# Altium project ZigBug.PrjPcb
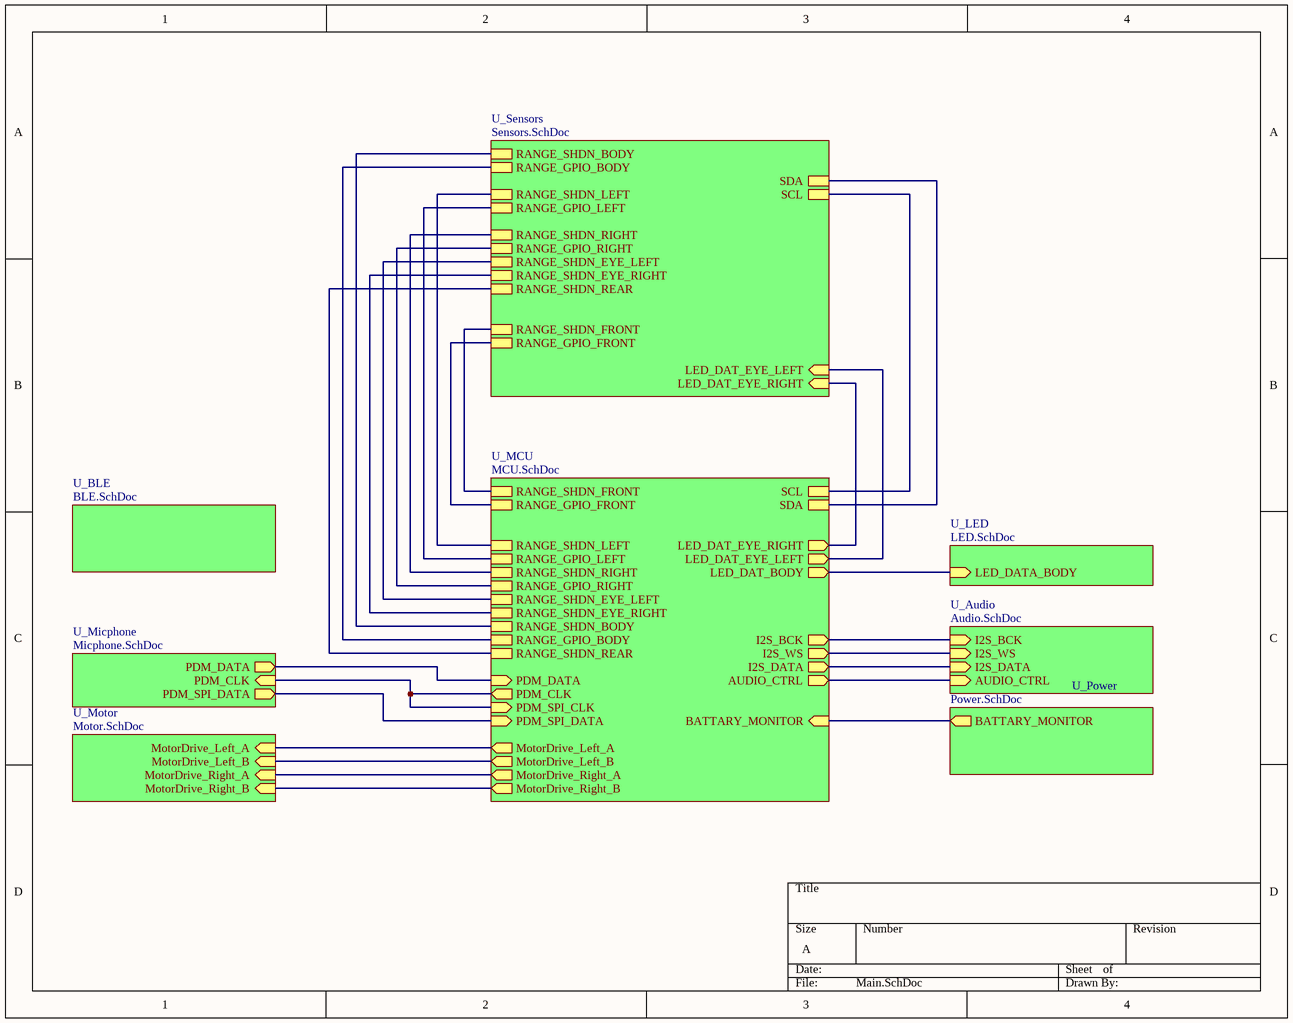
[diagram p0: Main.SchDoc]
9 sheets, 89 parts. Net scope: hierarchical (ports join the sheet entries above them; power ports are global).
Board file: ZigBug.PcbDoc
Sheets:
  Main.SchDoc
    U_Audio = Audio.SchDoc
    U_LED = LED.SchDoc
    U_MCU = MCU.SchDoc
    U_Micphone = Micphone.SchDoc
    U_Motor = Motor.SchDoc
    U_Power = Power.SchDoc
    U_Sensors = Sensors.SchDoc
    U_BLE = BLE.SchDoc

## Sheet Main.SchDoc
size A

### Sub-sheets
U_Audio = Audio.SchDoc: I2S_BCK (in), I2S_WS (in), I2S_DATA (in), AUDIO_CTRL (in)
U_BLE = BLE.SchDoc: no entries
U_LED = LED.SchDoc: LED_DATA_BODY (in)
U_MCU = MCU.SchDoc: RANGE_SHDN_FRONT, RANGE_GPIO_FRONT, SDA, SCL, LED_DAT_BODY (out), LED_DAT_EYE_RIGHT (out), LED_DAT_EYE_LEFT (out), RANGE_SHDN_LEFT, RANGE_GPIO_LEFT, RANGE_SHDN_RIGHT, RANGE_GPIO_RIGHT, RANGE_SHDN_EYE_LEFT, RANGE_SHDN_EYE_RIGHT, RANGE_SHDN_BODY, RANGE_GPIO_BODY, RANGE_SHDN_REAR, PDM_DATA (in), PDM_CLK (out), PDM_SPI_DATA (in), MotorDrive_Left_A (out), MotorDrive_Left_B (out), MotorDrive_Right_A (out), MotorDrive_Right_B (out), BATTARY_MONITOR (in), I2S_BCK (out), I2S_WS (out), I2S_DATA (out), PDM_SPI_CLK (in), AUDIO_CTRL (out)
U_Micphone = Micphone.SchDoc: PDM_DATA (out), PDM_CLK (in), PDM_SPI_DATA (out)
U_Motor = Motor.SchDoc: MotorDrive_Left_A (in), MotorDrive_Left_B (in), MotorDrive_Right_A (in), MotorDrive_Right_B (in)
U_Power = Power.SchDoc: BATTARY_MONITOR (out)
U_Sensors = Sensors.SchDoc: RANGE_SHDN_BODY, RANGE_GPIO_BODY, SDA, SCL, RANGE_SHDN_LEFT, RANGE_GPIO_LEFT, RANGE_SHDN_RIGHT, RANGE_GPIO_RIGHT, RANGE_SHDN_EYE_LEFT, RANGE_SHDN_EYE_RIGHT, RANGE_SHDN_REAR, RANGE_SHDN_FRONT, RANGE_GPIO_FRONT, LED_DAT_EYE_RIGHT (in), LED_DAT_EYE_LEFT (in)

### Nets
GPIO_OUT: sheet U_MCU/RANGE_GPIO_BODY, sheet U_Sensors/RANGE_GPIO_BODY
I2S_BCK: sheet U_Audio/I2S_BCK, sheet U_MCU/I2S_BCK
I2S_DATA: sheet U_Audio/I2S_DATA, sheet U_MCU/I2S_DATA
I2S_WS: sheet U_Audio/I2S_WS, sheet U_MCU/I2S_WS
LED_DATA: sheet U_LED/LED_DATA_BODY, sheet U_MCU/LED_DAT_BODY
SCL: sheet U_MCU/SCL, sheet U_Sensors/SCL
SDA: sheet U_MCU/SDA, sheet U_Sensors/SDA
SHDN: sheet U_MCU/RANGE_SHDN_BODY, sheet U_Sensors/RANGE_SHDN_BODY
NetC22_1: sheet U_MCU/BATTARY_MONITOR, sheet U_Power/BATTARY_MONITOR
NetP1_1: sheet U_MCU/RANGE_SHDN_LEFT, sheet U_Sensors/RANGE_SHDN_LEFT
NetP1_2: sheet U_MCU/RANGE_SHDN_FRONT, sheet U_Sensors/RANGE_SHDN_FRONT
NetP1_3: sheet U_MCU/RANGE_GPIO_LEFT, sheet U_Sensors/RANGE_GPIO_LEFT
NetP1_4: sheet U_MCU/RANGE_GPIO_FRONT, sheet U_Sensors/RANGE_GPIO_FRONT
NetP1_5: sheet U_MCU/RANGE_SHDN_RIGHT, sheet U_Sensors/RANGE_SHDN_RIGHT
NetP1_7: sheet U_MCU/RANGE_GPIO_RIGHT, sheet U_Sensors/RANGE_GPIO_RIGHT
NetP1_9: sheet U_MCU/RANGE_SHDN_EYE_LEFT, sheet U_Sensors/RANGE_SHDN_EYE_LEFT
NetP1_11: sheet U_MCU/RANGE_SHDN_EYE_RIGHT, sheet U_Sensors/RANGE_SHDN_EYE_RIGHT
NetP1_12: sheet U_MCU/MotorDrive_Right_B, sheet U_Motor/MotorDrive_Right_B
NetP1_13: sheet U_MCU/MotorDrive_Left_A, sheet U_Motor/MotorDrive_Left_A
NetP1_14: sheet U_MCU/PDM_CLK, sheet U_MCU/PDM_SPI_CLK, sheet U_Micphone/PDM_CLK
NetP1_15: sheet U_MCU/MotorDrive_Left_B, sheet U_Motor/MotorDrive_Left_B
NetP1_16: sheet U_MCU/PDM_SPI_DATA, sheet U_Micphone/PDM_SPI_DATA
NetP1_17: sheet U_MCU/MotorDrive_Right_A, sheet U_Motor/MotorDrive_Right_A
NetP2_6: sheet U_MCU/LED_DAT_EYE_RIGHT, sheet U_Sensors/LED_DAT_EYE_RIGHT
NetP2_7: sheet U_MCU/LED_DAT_EYE_LEFT, sheet U_Sensors/LED_DAT_EYE_LEFT
NetP2_9: sheet U_MCU/RANGE_SHDN_REAR, sheet U_Sensors/RANGE_SHDN_REAR
NetP2_11: sheet U_MCU/PDM_DATA, sheet U_Micphone/PDM_DATA
NetP2_18: sheet U_Audio/AUDIO_CTRL, sheet U_MCU/AUDIO_CTRL

## Sheet Audio.SchDoc
size A
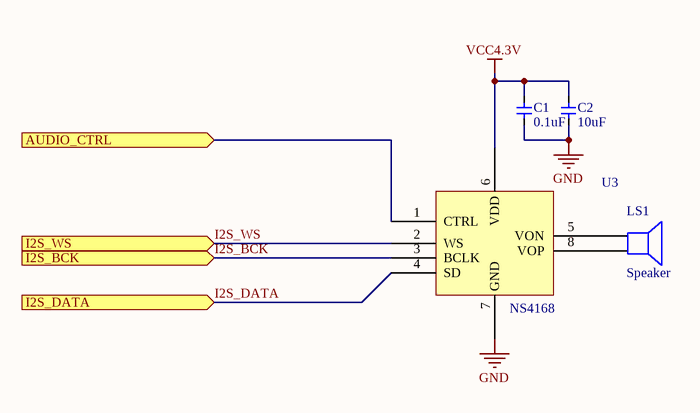
[diagram p1: Audio.SchDoc]

### Parts
C1  value 0.1uF  [CAP_0603]  (hidden comment: Cap_0603)
C2  value 10uF  [CAP_0603]  (hidden comment: Cap_0603)
LS1  Speaker  [PIN2]
U3  NS4168  [SOP_E150_8]

### Ports
AUDIO_CTRL (in), I2S_BCK (in), I2S_DATA (in), I2S_WS (in)

### Nets
GND: C1.1 C2.1 U3.7(GND)
VCC4.3V: C1.2 C2.2 U3.6(VDD)
I2S_BCK: U3.3(BCLK) ; port I2S_BCK
I2S_DATA: U3.4(SD) ; port I2S_DATA
I2S_WS: U3.2(WS) ; port I2S_WS
NetLS1_1: LS1.1 U3.5(VON)
NetLS1_2: LS1.2 U3.8(VOP)
NetP2_18: U3.1(CTRL) ; port AUDIO_CTRL

### Library data of the parts
C1 C2 = Cap_0603: Capacitor
LS1 = Speaker: Loudspeaker; Published: 24-Mar-1999; LatestRevisionDate: 17-Jul-2002; LatestRevisionNote: Re-released for DXP Platform.; PackageReference: PIN2; Publisher: Altium Limited
U3 = NS4168: D Class Audio Amp with I2S input

## Sheet LED.SchDoc
size A
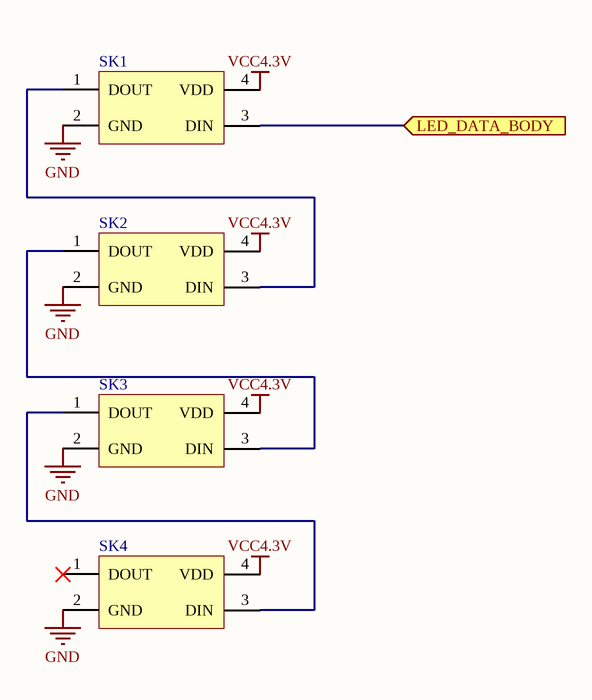
[diagram p2: LED.SchDoc]

### Parts
SK1  LED_3535_SK6812  [LED_3535_4P]  (value not drawn)
SK2  LED_3535_SK6812  [LED_3535_4P]  (value not drawn)
SK3  LED_3535_SK6812  [LED_3535_4P]  (value not drawn)
SK4  LED_3535_SK6812  [LED_3535_4P]  (value not drawn)

### Ports
LED_DATA_BODY (in)

### Nets
GND: SK1.2(GND) SK2.2(GND) SK3.2(GND) SK4.2(GND)
VCC4.3V: SK1.4(VDD) SK2.4(VDD) SK3.4(VDD) SK4.4(VDD)
LED_DATA: SK1.3(DIN) ; port LED_DATA_BODY
NetSK1_1: SK1.1(DOUT) SK2.3(DIN)
NetSK2_1: SK2.1(DOUT) SK3.3(DIN)
NetSK3_1: SK3.1(DOUT) SK4.3(DIN)

Not connected (* = marked no-connect by the designer): SK4 1(DOUT)*

### Library data of the parts
SK1-SK4 = LED_3535_SK6812: LED

## Sheet MCU.SchDoc
size A
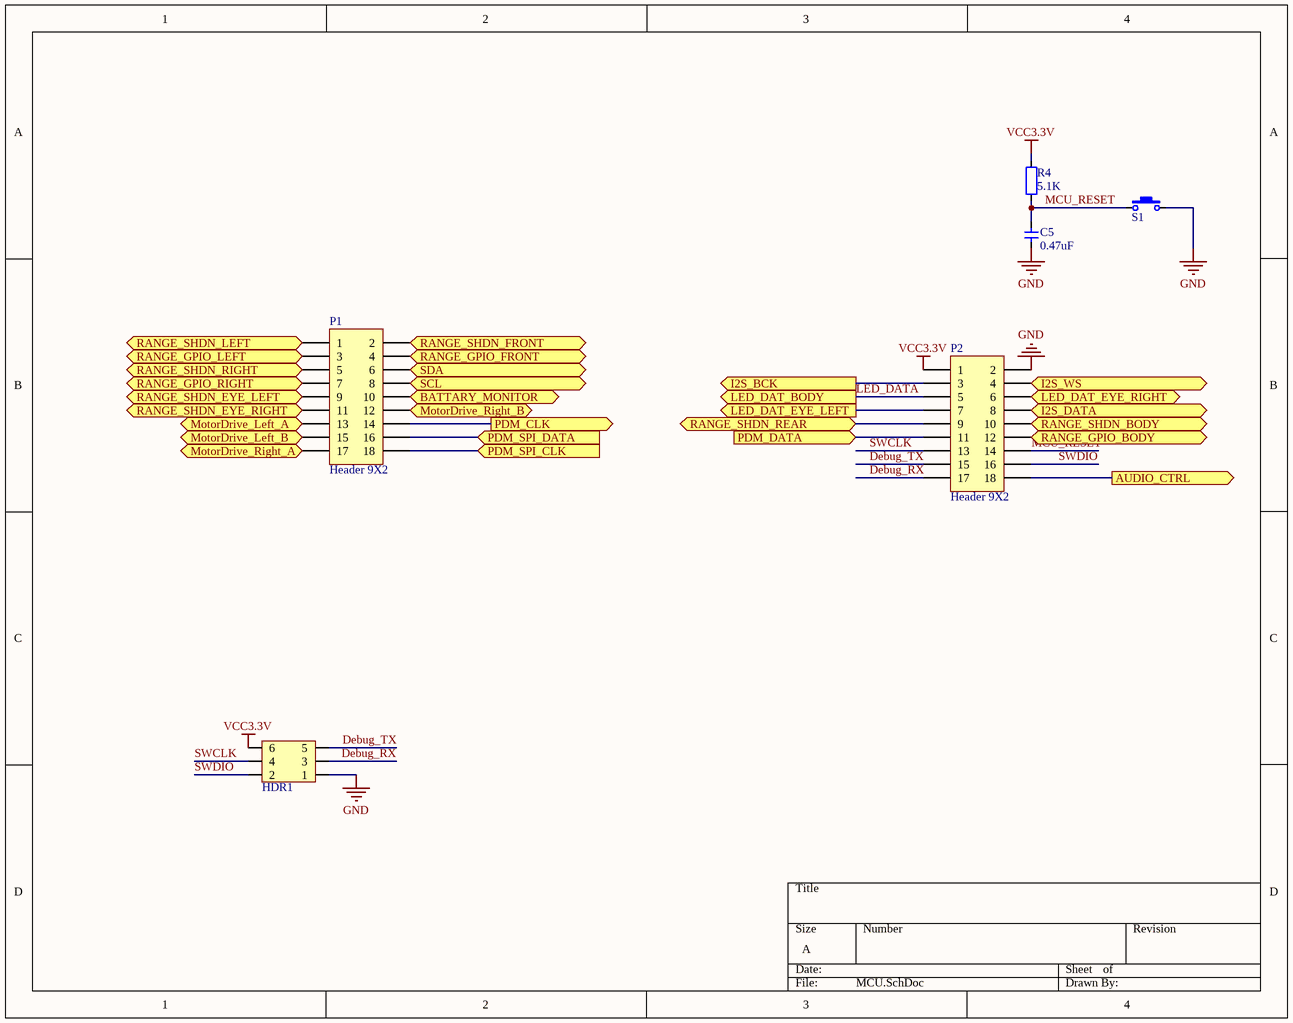
[diagram p3: MCU.SchDoc]

### Parts
C5  value 0.47uF  [CAP_0603]  (hidden comment: Cap_0603)
HDR1  HDR2x3_2.54  [HDR2X3_2.54_180]  (value not drawn)
P1  Header 9X2  [HDR2X9_2.00_180F]
P2  Header 9X2  [HDR2X9_2.00_180F]
R4  value 5.1K  [RES_0603]  (hidden comment: Res_0603)
S1  ButtonTACT_3x4x2_180  [ButtonTACT_3x4x2_180H]  (value not drawn)

### Ports
AUDIO_CTRL (out), BATTARY_MONITOR (in), I2S_BCK (out), I2S_DATA (out), I2S_WS (out), LED_DAT_BODY (out), LED_DAT_EYE_LEFT (out), LED_DAT_EYE_RIGHT (out), MotorDrive_Left_A (out), MotorDrive_Left_B (out), MotorDrive_Right_A (out), MotorDrive_Right_B (out), PDM_CLK (out), PDM_DATA (in), PDM_SPI_CLK (in), PDM_SPI_DATA (in), RANGE_GPIO_BODY, RANGE_GPIO_FRONT, RANGE_GPIO_LEFT, RANGE_GPIO_RIGHT, RANGE_SHDN_BODY, RANGE_SHDN_EYE_LEFT, RANGE_SHDN_EYE_RIGHT, RANGE_SHDN_FRONT, RANGE_SHDN_LEFT, RANGE_SHDN_REAR, RANGE_SHDN_RIGHT, SCL, SDA

### Nets
GND: C5.1 HDR1.1 P2.2 S1.2
VCC3.3V: HDR1.6 P2.1 R4.2
Debug_RX: HDR1.3 P2.17
Debug_TX: HDR1.5 P2.15
GPIO_OUT: P2.12 ; port RANGE_GPIO_BODY
I2S_BCK: P2.3 ; port I2S_BCK
I2S_DATA: P2.8 ; port I2S_DATA
I2S_WS: P2.4 ; port I2S_WS
LED_DATA: P2.5 ; port LED_DAT_BODY
MCU_RESET: C5.2 P2.14 R4.1 S1.1
SCL: P1.8 ; port SCL
SDA: P1.6 ; port SDA
SHDN: P2.10 ; port RANGE_SHDN_BODY
SWCLK: HDR1.4 P2.13
SWDIO: HDR1.2 P2.16
NetC22_1: P1.10 ; port BATTARY_MONITOR
NetP1_1: P1.1 ; port RANGE_SHDN_LEFT
NetP1_2: P1.2 ; port RANGE_SHDN_FRONT
NetP1_3: P1.3 ; port RANGE_GPIO_LEFT
NetP1_4: P1.4 ; port RANGE_GPIO_FRONT
NetP1_5: P1.5 ; port RANGE_SHDN_RIGHT
NetP1_7: P1.7 ; port RANGE_GPIO_RIGHT
NetP1_9: P1.9 ; port RANGE_SHDN_EYE_LEFT
NetP1_11: P1.11 ; port RANGE_SHDN_EYE_RIGHT
NetP1_12: P1.12 ; port MotorDrive_Right_B
NetP1_13: P1.13 ; port MotorDrive_Left_A
NetP1_14: P1.14 P1.18 ; port PDM_CLK, port PDM_SPI_CLK
NetP1_15: P1.15 ; port MotorDrive_Left_B
NetP1_16: P1.16 ; port PDM_SPI_DATA
NetP1_17: P1.17 ; port MotorDrive_Right_A
NetP2_6: P2.6 ; port LED_DAT_EYE_RIGHT
NetP2_7: P2.7 ; port LED_DAT_EYE_LEFT
NetP2_9: P2.9 ; port RANGE_SHDN_REAR
NetP2_11: P2.11 ; port PDM_DATA
NetP2_18: P2.18 ; port AUDIO_CTRL

### Library data of the parts
C5 = Cap_0603: Capacitor
HDR1 = HDR2x3_2.54: Header
P1 P2 = Header 9X2: Header, 9-Pin, Dual row; LatestRevisionDate: 17-Jul-2002; LatestRevisionNote: Re-released for DXP Platform.; Publisher: Altium Limited
R4 = Res_0603: Resistor
S1 = ButtonTACT_3x4x2_180: Button

## Sheet Micphone.SchDoc
size A
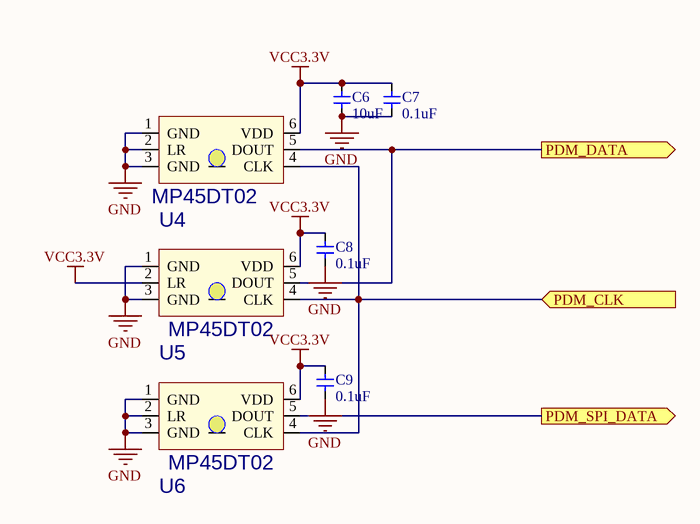
[diagram p4: Micphone.SchDoc]

### Parts
C6  value 10uF  [CAP_0603]  (hidden comment: Cap_0603)
C7  value 0.1uF  [CAP_0603]  (hidden comment: Cap_0603)
C8  value 0.1uF  [CAP_0603]  (hidden comment: Cap_0603)
C9  value 0.1uF  [CAP_0603]  (hidden comment: Cap_0603)
U4  MP45DT02  [ST_HLGA6]
U5  MP45DT02  [ST_HLGA6]
U6  MP45DT02  [ST_HLGA6]

### Ports
PDM_CLK (in), PDM_DATA (out), PDM_SPI_DATA (out)

### Nets
GND: C6.1 C7.1 C8.1 C9.1 U4.1(GND) U4.2(LR) U4.3(GND) U5.1(GND) U5.3(GND) U6.1(GND) U6.2(LR) U6.3(GND)
VCC3.3V: C6.2 C7.2 C8.2 C9.2 U4.6(VDD) U5.2(LR) U5.6(VDD) U6.6(VDD)
NetP1_14: U4.4(CLK) U5.4(CLK) U6.4(CLK) ; port PDM_CLK
NetP1_16: U6.5(DOUT) ; port PDM_SPI_DATA
NetP2_11: U4.5(DOUT) U5.5(DOUT) ; port PDM_DATA

### Library data of the parts
C6-C9 = Cap_0603: Capacitor
U4-U6 = MP45DT02: Mic Omni-Directional -26dB 3.6V Rectangular Solder Pad; MF: STMicroelectronics; MP: MP45DT02; Package: None; Availability: Good; Price: 2.57 USD; Value: *

## Sheet Motor.SchDoc
size A
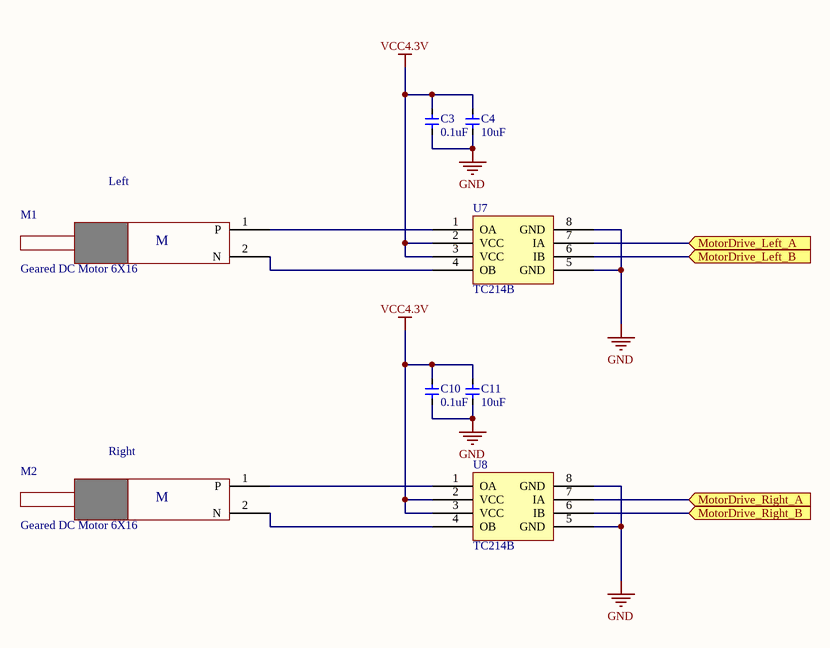
[diagram p5: Motor.SchDoc]

### Parts
C3  value 0.1uF  [CAP_0603]  (hidden comment: Cap_0603)
C4  value 10uF  [CAP_0603]  (hidden comment: Cap_0603)
C10  value 0.1uF  [CAP_0603]  (hidden comment: Cap_0603)
C11  value 10uF  [CAP_0603]  (hidden comment: Cap_0603)
M1  Geared DC Motor 6X16  [Geared_DC_Motor_6X16]
M2  Geared DC Motor 6X16  [Geared_DC_Motor_6X16]
U7  TC214B  [SOP_E150_8]
U8  TC214B  [SOP_E150_8]

### Ports
MotorDrive_Left_A (in), MotorDrive_Left_B (in), MotorDrive_Right_A (in), MotorDrive_Right_B (in)

### Nets
GND: C3.1 C4.1 C10.1 C11.1 U7.5(GND) U7.8(GND) U8.5(GND) U8.8(GND)
VCC4.3V: C3.2 C4.2 C10.2 C11.2 U7.2(VCC) U7.3(VCC) U8.2(VCC) U8.3(VCC)
NetM1_1: M1.1(P) U7.1(OA)
NetM1_2: M1.2(N) U7.4(OB)
NetM2_1: M2.1(P) U8.1(OA)
NetM2_2: M2.2(N) U8.4(OB)
NetP1_12: U8.6(IB) ; port MotorDrive_Right_B
NetP1_13: U7.7(IA) ; port MotorDrive_Left_A
NetP1_15: U7.6(IB) ; port MotorDrive_Left_B
NetP1_17: U8.7(IA) ; port MotorDrive_Right_A

### Notes on the sheet
- Left
- Right
- (in symbol GearMotor_DC_6X16) M

### Library data of the parts
C3 C4 C10 C11 = Cap_0603: Capacitor
M1 M2 = GearMotor_DC_6X16: Geared DC Motor, 6mm D, L=16mm
U7 U8 = TC214B: DC Motor Driver 1 Channel  (Cheap Replacement of L9110)

## Sheet Power.SchDoc
size A
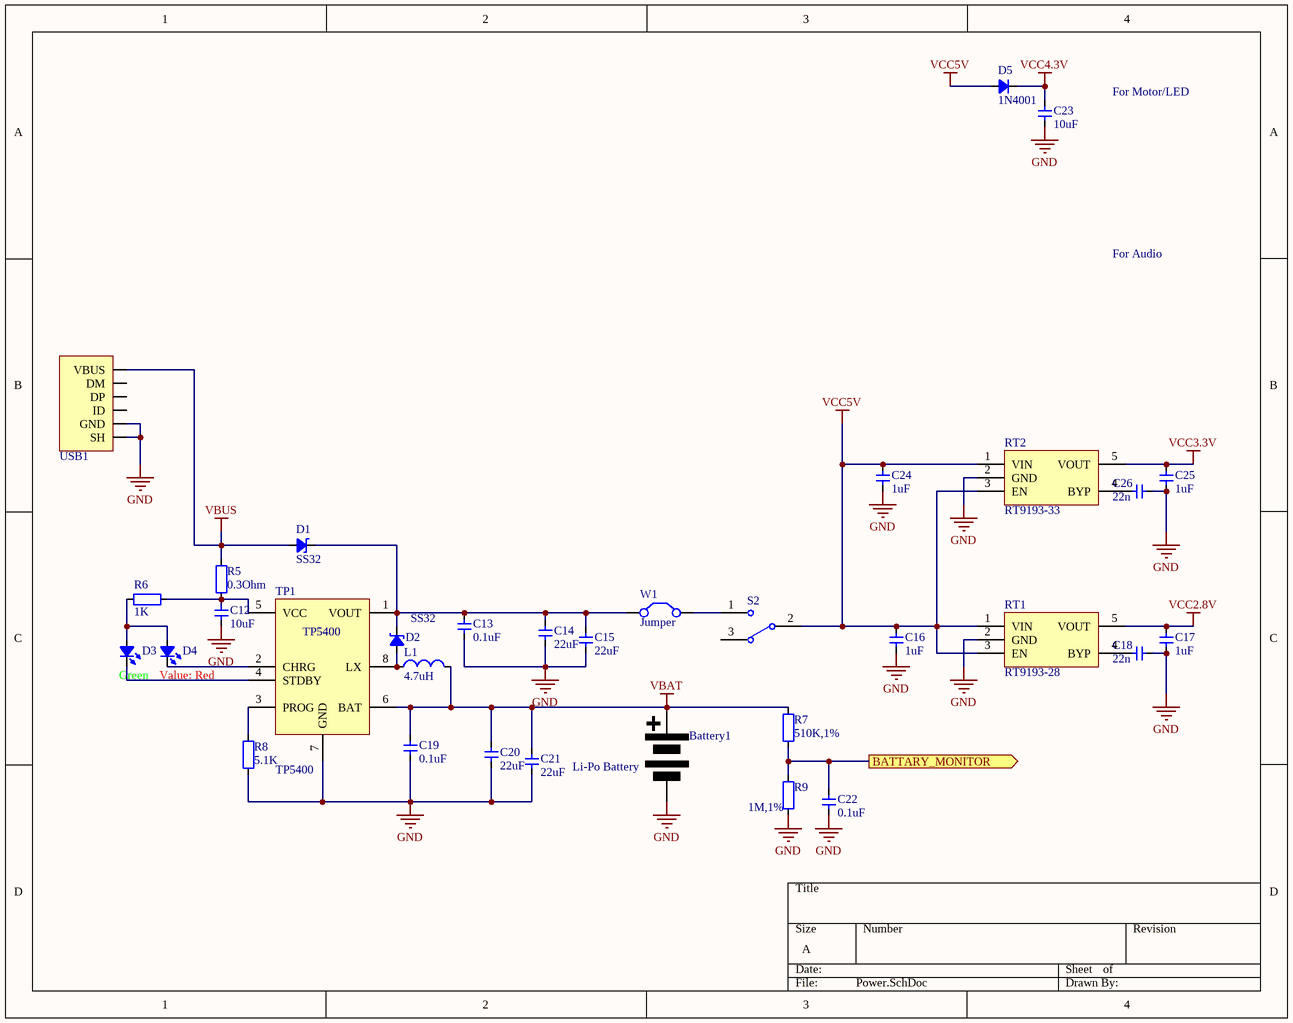
[diagram p6: Power.SchDoc]

### Parts
Battery1  Li-Po Battery  [HDR1X2_2.54_180]
C12  value 10uF  [CAP_0805]  (hidden comment: Cap_0805)
C13  value 0.1uF  [CAP_0603]  (hidden comment: Cap_0603)
C14  value 22uF  [CAP_0805]  (hidden comment: Cap_0805)
C15  value 22uF  [CAP_0805]  (hidden comment: Cap_0805)
C16  value 1uF  [CAP_0603]  (hidden comment: Cap_0603)
C17  value 1uF  [CAP_0603]  (hidden comment: Cap_0603)
C18  value 22n  [CAP_0402]  (hidden comment: Cap_0402)
C19  value 0.1uF  [CAP_0603]  (hidden comment: Cap_0603)
C20  value 22uF  [CAP_0805]  (hidden comment: Cap_0805)
C21  value 22uF  [CAP_0805]  (hidden comment: Cap_0805)
C22  value 0.1uF  [CAP_0603]  (hidden comment: Cap_0603)
C23  value 10uF  [CAP_0603]  (hidden comment: Cap_0603)
C24  value 1uF  [CAP_0603]  (hidden comment: Cap_0603)
C25  value 1uF  [CAP_0603]  (hidden comment: Cap_0603)
C26  value 22n  [CAP_0402]  (hidden comment: Cap_0402)
D1  value SS32  [DO-214AC]  (hidden comment: SchottkyDiode_SOD123)
D2  value SS32  [DO-214AC]  (hidden comment: SchottkyDiode_SOD123)
D3  value Green  [LED_0603_RED]  (hidden comment: Green LED 0603)
D4  value Red  [LED_0603_RED]  (hidden comment: Red LED 0603)
D5  value 1N4001  [DO-214AC]  (hidden comment: IN4001)
L1  value 4.7uH  [IND_CD32]  (hidden comment: Ind_CD32)
R5  value 0.3Ohm  [RES_0603]  (hidden comment: Res_0603)
R6  value 1K  [RES_0603]  (hidden comment: Res_0603)
R7  value 510K,1%  [RES_0603]  (hidden comment: Res_0603)
R8  value 5.1K  [RES_0603]  (hidden comment: Res_0603)
R9  value 1M,1%  [RES_0603]  (hidden comment: Res_0603)
RT1  RT9193-28  [SOT23-5]
RT2  RT9193-33  [SOT23-5]
S2  SwitchSPDT_2.8x6.6_90  [SwitchSPDT_2.8X6.6_90]  (value not drawn)
TP1  TP5400  [SOP_E150_8]
USB1  USB Mini-B  [USB_Micro-AB]  (value not drawn)
W1  Jumper  [HDR1X2]

### Ports
BATTARY_MONITOR (out)

### Nets
GND: Battery1.1(-) C12.2 C13.1 C14.2 C15.2 C16.2 C17.1 C18.2 C19.1 C20.2 C21.2 C22.2 C23.1 C24.2 C25.1 C26.2 R8.1 R9.1 RT1.2(GND) RT2.2(GND) TP1.7(GND) USB1.0(SH) USB1.5(GND)
VBAT: Battery1.2(+) C19.2 C20.1 C21.1 L1.2 R7.2 TP1.6(BAT)
VBUS: D1.1(A) R5.2 USB1.1(VBUS)
VCC2.8V: C17.2 RT1.5(VOUT)
VCC3.3V: C25.2 RT2.5(VOUT)
VCC4.3V: C23.2 D5.2(K)
VCC5V: C16.1 C24.1 D5.1(A) RT1.1(VIN) RT1.3(EN) RT2.1(VIN) RT2.3(EN) S2.2
NetC12_1: C12.1 R5.1 R6.2 TP1.5(VCC)
NetC13_2: C13.2 C14.1 C15.1 D1.2(K) D2.2(K) TP1.1(VOUT) W1.1(C1)
NetC18_1: C18.1 RT1.4(BYP)
NetC22_1: C22.1 R7.1 R9.2 ; port BATTARY_MONITOR
NetC26_1: C26.1 RT2.4(BYP)
NetD2_1: D2.1(A) L1.1 TP1.8(LX)
NetD3_1: D3.1(A) D4.1(A) R6.1
NetD3_2: D3.2(K) TP1.4(STDBY)
NetD4_2: D4.2(K) TP1.2(CHRG)
NetR8_2: R8.2 TP1.3(PROG)
NetS2_1: S2.1 W1.2(C2)

Not connected (* = marked no-connect by the designer): S2 3; USB1 2(DM) 3(DP) 4(ID)

### Notes on the sheet
- For Motor/LED
- For Audio

### Library data of the parts
Battery1 = Battery_LiPo: Li-Po Rechargable Battery
C12 C14 C15 C20 C21 = Cap_0805: Capacitor
C13 C16 C17 C19 C22-C25 = Cap_0603: Capacitor
C18 C26 = Cap_0402: Capacitor
D1 D2 = SchottkyDiode_SOD123: Diode
D3 D4 = LED_0603: LED
D5 = Diode_SMA: Diode
L1 = Ind_CD32: Inductor
R5-R9 = Res_0603: Resistor
RT1 RT2 = RT9193: Power
S2 = SwitchSPDT_2.8x6.6_90: Switch
TP1 = TP5400: Charge
USB1 = USB_Micro: USB
W1 = Jumper: Jumper Wire; Published: 24-Mar-1999; LatestRevisionDate: 17-Jul-2002; LatestRevisionNote: Re-released for DXP Platform.; PackageReference: RAD-0.2; Publisher: Altium Limited; PackageDescription: Radial Cap, Thru-Hole; 2 Leads; 0.2 in Pin Spacing

## Sheet Sensors.SchDoc
size A
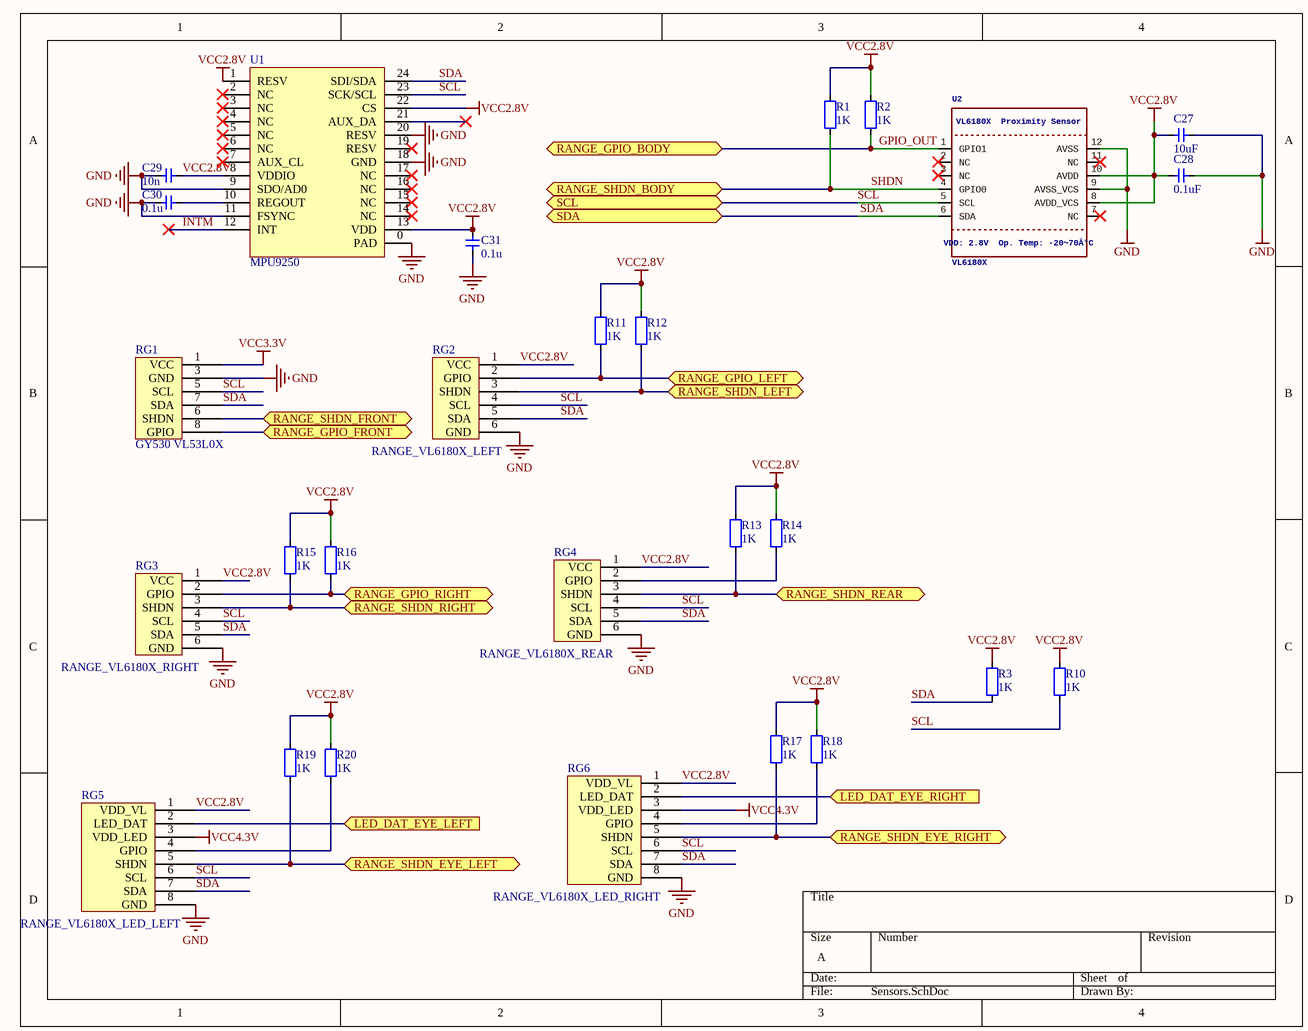
[diagram p7: Sensors.SchDoc]

### Parts
C27  value 10uF  [CAP_0805]  (hidden comment: Cap_0805)
C28  value 0.1uF  [CAP_0603]  (hidden comment: Cap_0603)
C29  value 10n  [CAP_0402]  (hidden comment: Cap_0402)
C30  value 0.1u  [CAP_0402]  (hidden comment: Cap_0402)
C31  value 0.1u  [CAP_0402]  (hidden comment: Cap_0402)
R1  value 1K  [RES_0603]  (hidden comment: Res_0603)
R2  value 1K  [RES_0603]  (hidden comment: Res_0603)
R3  value 1K  [RES_0603]  (hidden comment: Res_0603)
R10  value 1K  [RES_0603]  (hidden comment: Res_0603)
R11  value 1K  [RES_0603]  (hidden comment: Res_0603)
R12  value 1K  [RES_0603]  (hidden comment: Res_0603)
R13  value 1K  [RES_0603]  (hidden comment: Res_0603)
R14  value 1K  [RES_0603]  (hidden comment: Res_0603)
R15  value 1K  [RES_0603]  (hidden comment: Res_0603)
R16  value 1K  [RES_0603]  (hidden comment: Res_0603)
R17  value 1K  [RES_0603]  (hidden comment: Res_0603)
R18  value 1K  [RES_0603]  (hidden comment: Res_0603)
R19  value 1K  [RES_0603]  (hidden comment: Res_0603)
R20  value 1K  [RES_0603]  (hidden comment: Res_0603)
RG1  GY530 VL53L0X  [HDR2X4_2.54_180]
RG2  RANGE_VL6180X_LEFT  [HDR1X6_1.27_180H_SMD]
RG3  RANGE_VL6180X_RIGHT  [HDR1X6_1.27_180H_SMD]
RG4  RANGE_VL6180X_REAR  [HDR1X6_1.27_180]
RG5  RANGE_VL6180X_LED_LEFT  [HDR1X8_1.27_180]
RG6  RANGE_VL6180X_LED_RIGHT  [HDR1X8_1.27_180]
U1  MPU9250  [QFN_P0.4_24]
U2  VL6180X  VL6180X
ProximitySensor: VL6180X / Proximity Sensor  VDD:2.8V
Op.Temp:-20~70Â°C: VDD: 2.8V / Op. Temp: -20~70Â°C  [LGA12_ST_4.8X2.8X1MM]

### Ports
LED_DAT_EYE_LEFT (in), LED_DAT_EYE_RIGHT (in), RANGE_GPIO_BODY, RANGE_GPIO_FRONT, RANGE_GPIO_LEFT, RANGE_GPIO_RIGHT, RANGE_SHDN_BODY, RANGE_SHDN_EYE_LEFT, RANGE_SHDN_EYE_RIGHT, RANGE_SHDN_FRONT, RANGE_SHDN_LEFT, RANGE_SHDN_REAR, RANGE_SHDN_RIGHT, SCL, SDA

### Nets
GND: C27.1 C28.1 C29.1 C30.1 C31.1 RG1.3(GND) RG2.6(GND) RG3.6(GND) RG4.6(GND) RG5.8(GND) RG6.8(GND) U1.0(PAD) U1.9(SDO/AD0) U1.11(FSYNC) U1.18(GND) U1.20(RESV) U2.9(AVSS_VCS) U2.12(AVSS)
VCC2.8V: C27.2 C28.2 C29.2 C31.2 R1.2 R2.2 R3.2 R10.2 R11.2 R12.2 R13.2 R14.2 R15.2 R16.2 R17.2 R18.2 R19.2 R20.2 RG2.1(VCC) RG3.1(VCC) RG4.1(VCC) RG5.1(VDD_VL) RG6.1(VDD_VL) U1.1(RESV) U1.8(VDDIO) U1.13(VDD) U1.22(CS) U2.8(AVDD_VCS) U2.10(AVDD)
VCC3.3V: RG1.1(VCC)
VCC4.3V: RG5.3(VDD_LED) RG6.3(VDD_LED)
GPIO_OUT: R2.1 U2.1(GPIO1) ; port RANGE_GPIO_BODY
INTM: U1.12(INT)
SCL: R10.1 RG1.5(SCL) RG2.4(SCL) RG3.4(SCL) RG4.4(SCL) RG5.6(SCL) RG6.6(SCL) U1.23(SCK/SCL) U2.5(SCL) ; port SCL
SDA: R3.1 RG1.7(SDA) RG2.5(SDA) RG3.5(SDA) RG4.5(SDA) RG5.7(SDA) RG6.7(SDA) U1.24(SDI/SDA) U2.6(SDA) ; port SDA
SHDN: R1.1 U2.4(GPIO0) ; port RANGE_SHDN_BODY
NetC30_2: C30.2 U1.10(REGOUT)
NetP1_1: R12.1 RG2.3(SHDN) ; port RANGE_SHDN_LEFT
NetP1_2: RG1.6(SHDN) ; port RANGE_SHDN_FRONT
NetP1_3: R11.1 RG2.2(GPIO) ; port RANGE_GPIO_LEFT
NetP1_4: RG1.8(GPIO) ; port RANGE_GPIO_FRONT
NetP1_5: R15.1 RG3.3(SHDN) ; port RANGE_SHDN_RIGHT
NetP1_7: R16.1 RG3.2(GPIO) ; port RANGE_GPIO_RIGHT
NetP1_9: R19.1 RG5.5(SHDN) ; port RANGE_SHDN_EYE_LEFT
NetP1_11: R17.1 RG6.5(SHDN) ; port RANGE_SHDN_EYE_RIGHT
NetP2_6: RG6.2(LED_DAT) ; port LED_DAT_EYE_RIGHT
NetP2_7: RG5.2(LED_DAT) ; port LED_DAT_EYE_LEFT
NetP2_9: R13.1 RG4.3(SHDN) ; port RANGE_SHDN_REAR
NetR14_1: R14.1 RG4.2(GPIO)
NetR18_1: R18.1 RG6.4(GPIO)
NetR20_1: R20.1 RG5.4(GPIO)

Not connected (* = marked no-connect by the designer): U1 2(NC)* 3(NC)* 4(NC)* 5(NC)* 6(NC)* 7(AUX_CL)* 14(NC)* 15(NC)* 16(NC)* 17(NC)* 19(RESV)* 21(AUX_DA)*; U2 2(NC)* 3(NC)* 7(NC)* 11(NC)*

### Library data of the parts
C27 = Cap_0805: Capacitor
C28 = Cap_0603: Capacitor
C29-C31 = Cap_0402: Capacitor
R1-R3 R10-R20 = Res_0603: Resistor
RG1 = GY530-VL53L0X: For font range detection VL53L0X
RG2-RG4 = RANGE_VL6180X
RG5 RG6 = RANGE_VL6180X_LED
U1 = MPU925x: Sensor Motion
U2 = VL6180X: VL6180x Proximity and Light Sensor with Gesture Recognition    Supply Level: 2.8V (3.0V Max!)  Range: 0-10cm  Light Sensor: 0..100K Lux (16-bit output)  IR emitter: 850 nm  I2C Address: 0x29 (7-bit)

## Sheet BLE.SchDoc
size A

## Nets that join several sheets
GND: Audio (C1.1 C2.1 U3.7), LED (SK1.2 SK2.2 SK3.2 SK4.2), MCU (C5.1 HDR1.1 P2.2 S1.2), Micphone (12 pins), Motor (8 pins), Power (23 pins), Sensors (18 pins)
VCC2.8V: Power (C17.2 RT1.5), Sensors (29 pins)
VCC3.3V: MCU (HDR1.6 P2.1 R4.2), Micphone (8 pins), Power (C25.2 RT2.5), Sensors (RG1.1)
VCC4.3V: Audio (C1.2 C2.2 U3.6), LED (SK1.4 SK2.4 SK3.4 SK4.4), Motor (8 pins), Power (C23.2 D5.2), Sensors (RG5.3 RG6.3)
GPIO_OUT: MCU (P2.12), Sensors (R2.1 U2.1)
I2S_BCK: Audio (U3.3), MCU (P2.3)
I2S_DATA: Audio (U3.4), MCU (P2.8)
I2S_WS: Audio (U3.2), MCU (P2.4)
LED_DATA: LED (SK1.3), MCU (P2.5)
NetC22_1: MCU (P1.10), Power (C22.1 R7.1 R9.2)
NetP1_1: MCU (P1.1), Sensors (R12.1 RG2.3)
NetP1_2: MCU (P1.2), Sensors (RG1.6)
NetP1_3: MCU (P1.3), Sensors (R11.1 RG2.2)
NetP1_4: MCU (P1.4), Sensors (RG1.8)
NetP1_5: MCU (P1.5), Sensors (R15.1 RG3.3)
NetP1_7: MCU (P1.7), Sensors (R16.1 RG3.2)
NetP1_9: MCU (P1.9), Sensors (R19.1 RG5.5)
NetP1_11: MCU (P1.11), Sensors (R17.1 RG6.5)
NetP1_12: MCU (P1.12), Motor (U8.6)
NetP1_13: MCU (P1.13), Motor (U7.7)
NetP1_14: MCU (P1.14 P1.18), Micphone (U4.4 U5.4 U6.4)
NetP1_15: MCU (P1.15), Motor (U7.6)
NetP1_16: MCU (P1.16), Micphone (U6.5)
NetP1_17: MCU (P1.17), Motor (U8.7)
NetP2_6: MCU (P2.6), Sensors (RG6.2)
NetP2_7: MCU (P2.7), Sensors (RG5.2)
NetP2_9: MCU (P2.9), Sensors (R13.1 RG4.3)
NetP2_11: MCU (P2.11), Micphone (U4.5 U5.5)
NetP2_18: Audio (U3.1), MCU (P2.18)
SCL: MCU (P1.8), Sensors (9 pins)
SDA: MCU (P1.6), Sensors (9 pins)
SHDN: MCU (P2.10), Sensors (R1.1 U2.4)